# EasyEDA Pro project 无刷电机驱动板.epro, schematic Schematic2
Board Name: cyt无刷电机驱动V1.2; Create Date: 2025-03-28; Page Name: P1; Project Name: 无刷电机驱动板; Schematic Name: Schematic2; Update Date: 2025-07-04; Company: 海思路999号412所; Drawed: YienMaster; Page Size: A3; Version: V1.0
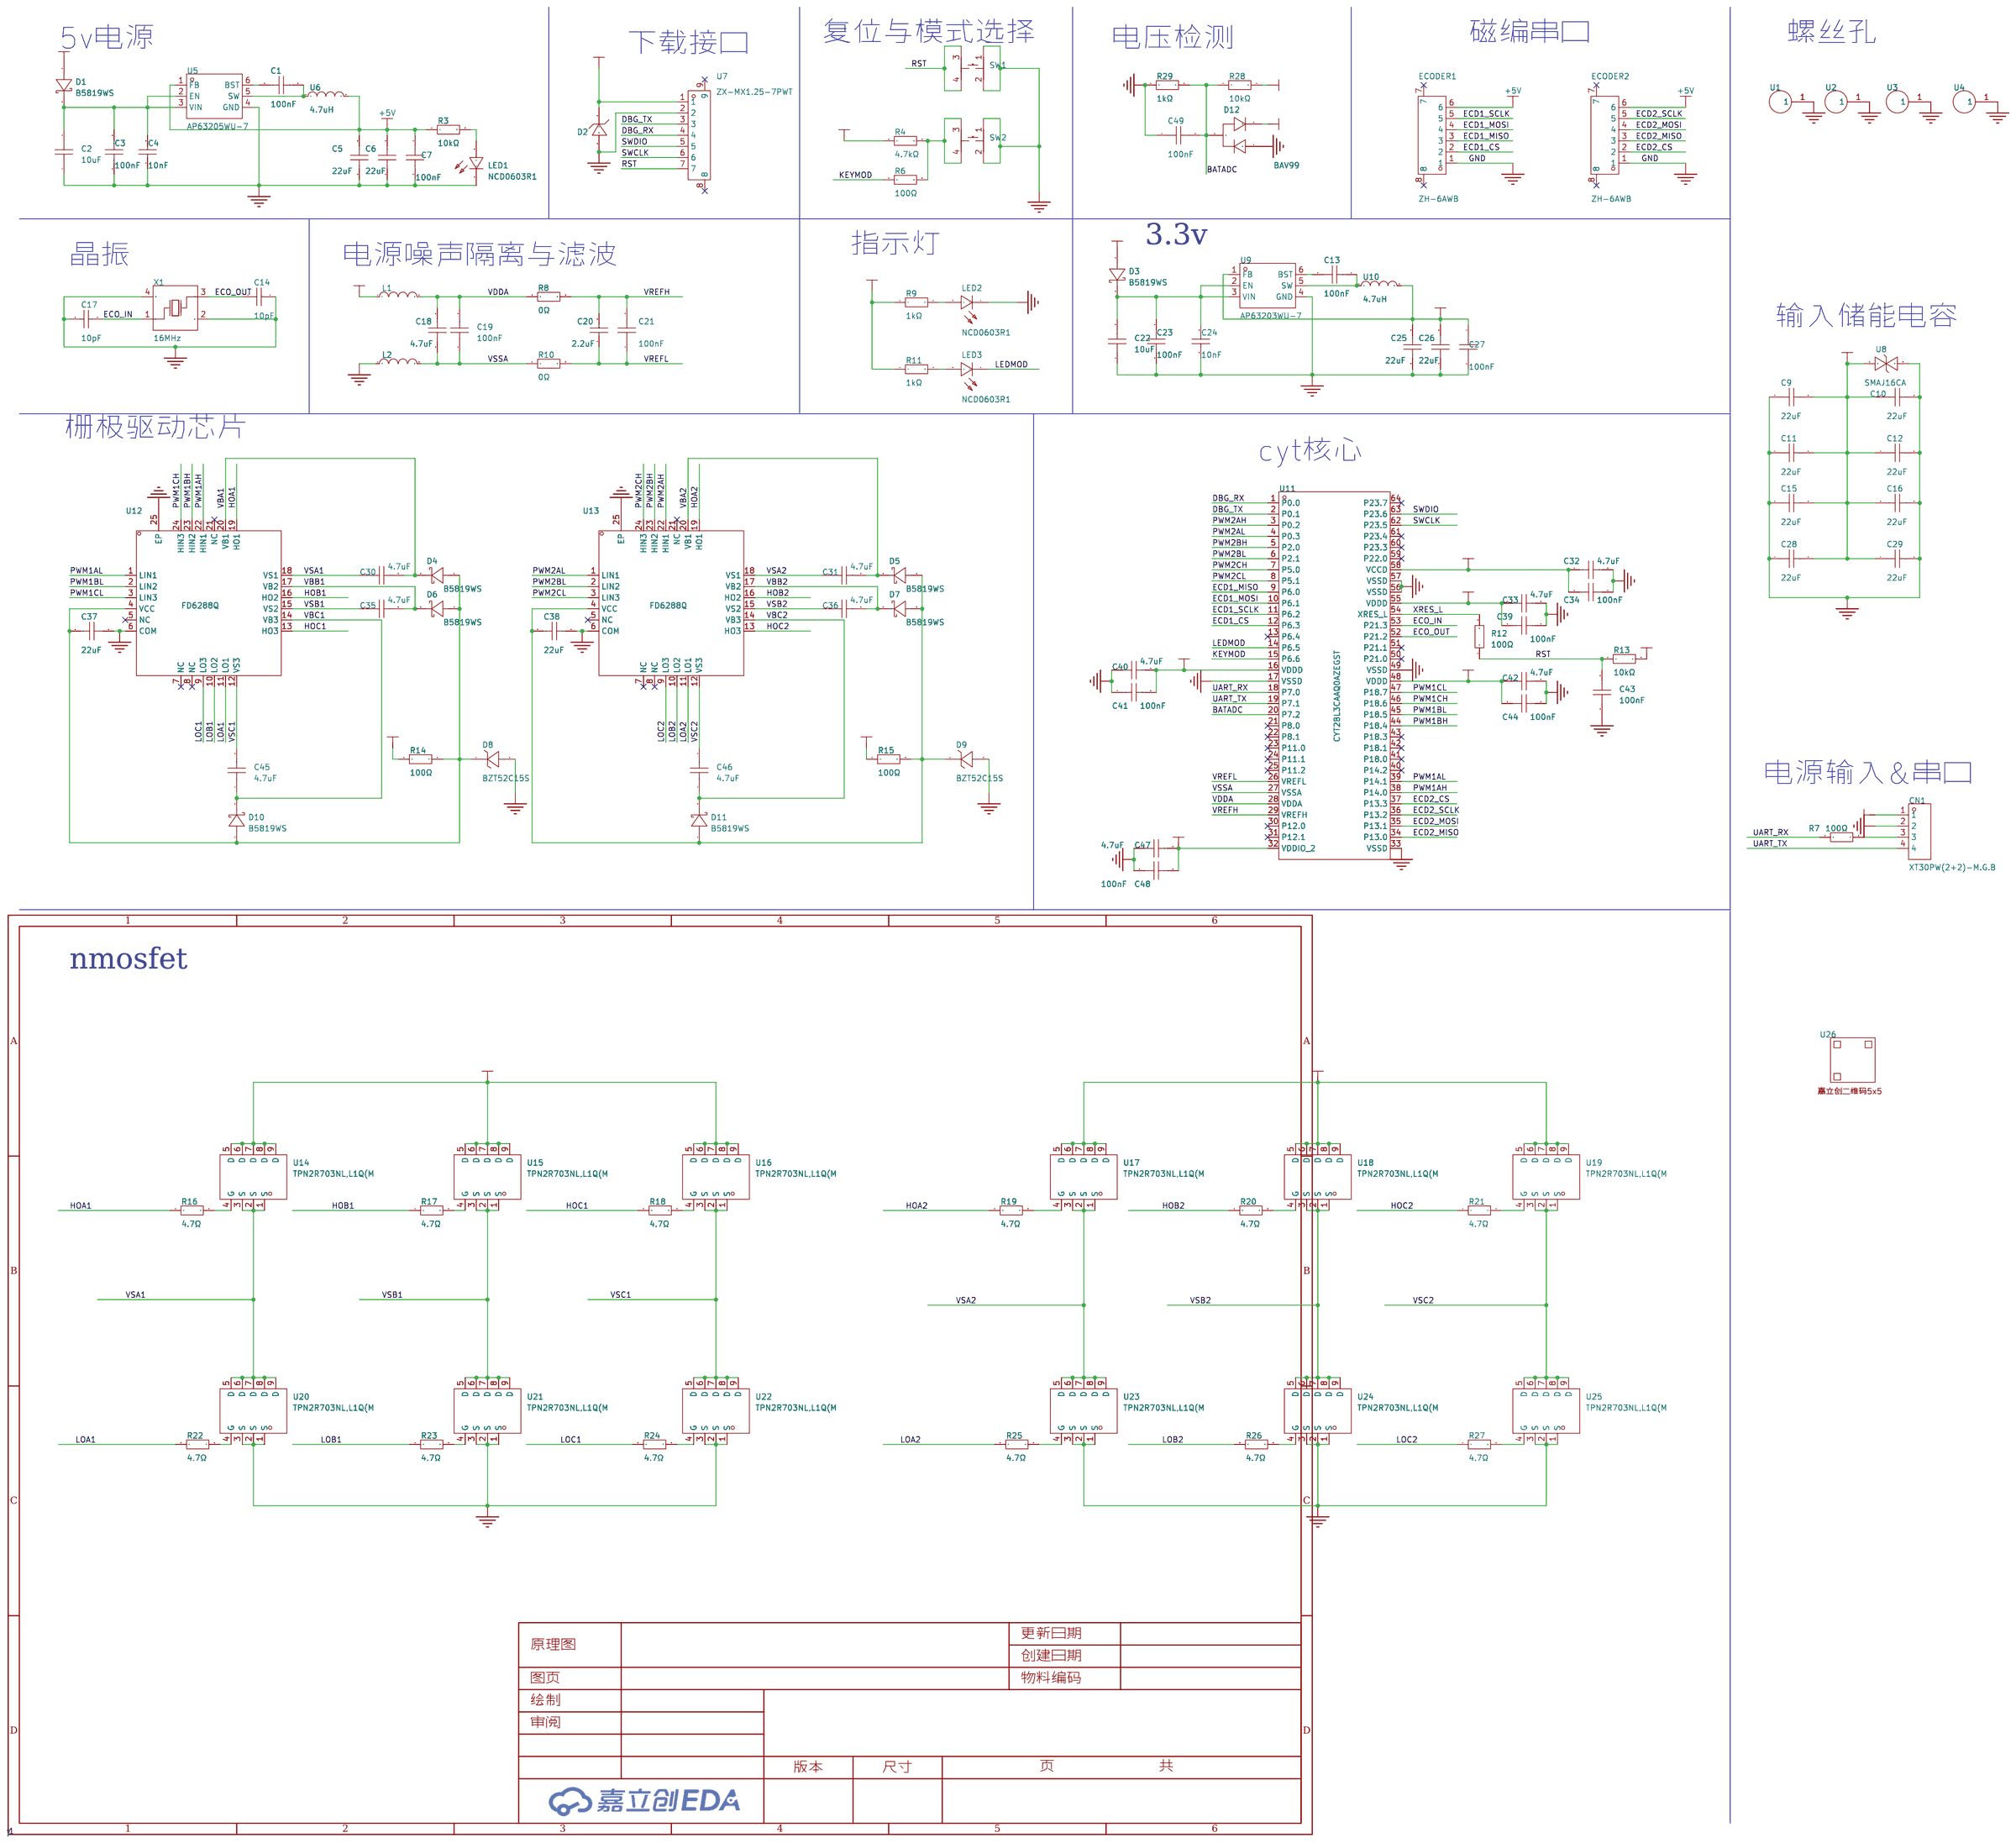
[diagram p3: schematic sheet]

## Parts
C1  100nF  [C0603]
C2  10uF  [C0603]
C3  100nF  [C0603]
C4  10nF  [C0603]
C5  22uF  [C0603]
C6  22uF  [C0603]
C7  100nF  [C0603]
C9  22uF  [C0805]
C10  22uF  [C0805]
C11  22uF  [C0805]
C12  22uF  [C0805]
C13  100nF  [C0603]
C14  10pF  [C0603]
C15  22uF  [C0805]
C16  22uF  [C0805]
C17  10pF  [C0603]
C18  4.7uF  [C0603]
C19  100nF  [C0603]
C20  2.2uF  [C0603]
C21  100nF  [C0603]
C22  10uF  [C0603]
C23  100nF  [C0603]
C24  10nF  [C0603]
C25  22uF  [C0603]
C26  22uF  [C0603]
C27  100nF  [C0603]
C28  22uF  [C0805]
C29  22uF  [C0805]
C30  4.7uF  [C0603]
C31  4.7uF  [C0603]
C32  4.7uF  [C0603]
C33  4.7uF  [C0603]
C34  100nF  [C0603]
C35  4.7uF  [C0603]
C36  4.7uF  [C0603]
C37  22uF  [C0805]
C38  22uF  [C0805]
C39  100nF  [C0603]
C40  4.7uF  [C0603]
C41  100nF  [C0603]
C42  4.7uF  [C0603]
C43  100nF  [C0603]
C44  100nF  [C0603]
C45  4.7uF  [C0603]
C46  4.7uF  [C0603]
C47  4.7uF  [C0603]
C48  100nF  [C0603]
C49  100nF  [C0603]
CN1  XT30PW(2+2)-M.G.B  [CONN-TH_4P-XT30PW-M]
D1  B5819WS  [SOD-323_L1.7-W1.3-LS2.5-FD]
D2  SMF3.3A  [SOD-123_L2.8-W1.8-LS3.7-RD]
D3  B5819WS  [SOD-323_L1.7-W1.3-LS2.5-FD]
D4  B5819WS  [SOD-323_L1.7-W1.3-LS2.5-FD]
D5  B5819WS  [SOD-323_L1.7-W1.3-LS2.5-FD]
D6  B5819WS  [SOD-323_L1.7-W1.3-LS2.5-FD]
D7  B5819WS  [SOD-323_L1.7-W1.3-LS2.5-FD]
D8  BZT52C15S  [SOD-323_L1.7-W1.3-LS2.6-RD]
D9  BZT52C15S  [SOD-323_L1.7-W1.3-LS2.6-RD]
D10  B5819WS  [SOD-323_L1.7-W1.3-LS2.5-FD]
D11  B5819WS  [SOD-323_L1.7-W1.3-LS2.5-FD]
D12  BAV99  [SOT-23_L2.9-W1.3-P1.90-LS2.4-BR]
ECODER1  ZH-6AWB  [CONN-SMD_6P-P1.50_ZH-6AWB]
ECODER2  ZH-6AWB  [CONN-SMD_6P-P1.50_ZH-6AWB]
L1  BLM18PG121SN1D  [L0603]
L2  BLM18PG121SN1D  [L0603]
LED1  NCD0603R1  [LED0603-RD_RED]
LED2  NCD0603R1  [LED0603-RD_RED]
LED3  NCD0603R1  [LED0603-RD_RED]
R3  10kΩ  [R0603]
R4  4.7kΩ  [R0603]
R6  100Ω  [R0603]
R7  100Ω  [R0603]
R8  0Ω  [R0603]
R9  1kΩ  [R0603]
R10  0Ω  [R0603]
R11  1kΩ  [R0603]
R12  100Ω  [R0603]
R13  10kΩ  [R0603]
R14  100Ω  [R0603]
R15  100Ω  [R0603]
R16  4.7Ω  [R0603]
R17  4.7Ω  [R0603]
R18  4.7Ω  [R0603]
R19  4.7Ω  [R0603]
R20  4.7Ω  [R0603]
R21  4.7Ω  [R0603]
R22  4.7Ω  [R0603]
R23  4.7Ω  [R0603]
R24  4.7Ω  [R0603]
R25  4.7Ω  [R0603]
R26  4.7Ω  [R0603]
R27  4.7Ω  [R0603]
R28  10kΩ  [R0603]
R29  1kΩ  [R0603]
SW1  TS3425BA  [SW-SMD_4P-L4.2-W3.2-P2.15-LS4.6-1]
SW2  TS3425BA  [SW-SMD_4P-L4.2-W3.2-P2.15-LS4.6-1]
U1  -  [M3螺丝孔]  (no BOM)
U2  -  [M3螺丝孔]  (no BOM)
U3  -  [M3螺丝孔]  (no BOM)
U4  -  [M3螺丝孔]  (no BOM)
U5  AP63205WU-7  [TSOT-23-6_L2.9-W1.6-P0.95-LS2.8-BL]
U6  4.7uH  [IND-SMD_L3.0-W3.0_FTC303020D]
U7  ZX-MX1.25-7PWT  [CONN-SMD_7P-P1.25_ZX-MX1.25-7PWT]
U8  SMAJ16CA  [DO-214AC_L4.3-W2.7-LS5.0-BI]
U9  AP63203WU-7  [TSOT-26_L2.9-W1.6-P0.95-LS2.8-BL]
U10  4.7uH  [IND-SMD_L3.0-W3.0_FTC303020D]
U11  CYT2BL3CAAQ0AZEGST  [LQFP-64_L10.0-W10.0-P0.50-LS12.0-BL]
U12  FD6288Q  [QFN-24_L4.0-W4.0-P0.50-BL-EP2.6]
U13  FD6288Q  [QFN-24_L4.0-W4.0-P0.50-BL-EP2.6]
U14  TPN2R703NL,L1Q(M  [TSON-8_L3.1-W3.1-P0.65-LS3.3-BL-EP]
U15  TPN2R703NL,L1Q(M  [TSON-8_L3.1-W3.1-P0.65-LS3.3-BL-EP]
U16  TPN2R703NL,L1Q(M  [TSON-8_L3.1-W3.1-P0.65-LS3.3-BL-EP]
U17  TPN2R703NL,L1Q(M  [TSON-8_L3.1-W3.1-P0.65-LS3.3-BL-EP]
U18  TPN2R703NL,L1Q(M  [TSON-8_L3.1-W3.1-P0.65-LS3.3-BL-EP]
U19  TPN2R703NL,L1Q(M  [TSON-8_L3.1-W3.1-P0.65-LS3.3-BL-EP]
U20  TPN2R703NL,L1Q(M  [TSON-8_L3.1-W3.1-P0.65-LS3.3-BL-EP]
U21  TPN2R703NL,L1Q(M  [TSON-8_L3.1-W3.1-P0.65-LS3.3-BL-EP]
U22  TPN2R703NL,L1Q(M  [TSON-8_L3.1-W3.1-P0.65-LS3.3-BL-EP]
U23  TPN2R703NL,L1Q(M  [TSON-8_L3.1-W3.1-P0.65-LS3.3-BL-EP]
U24  TPN2R703NL,L1Q(M  [TSON-8_L3.1-W3.1-P0.65-LS3.3-BL-EP]
U25  TPN2R703NL,L1Q(M  [TSON-8_L3.1-W3.1-P0.65-LS3.3-BL-EP]
U26  -  [JLC-QRCODE-5x5]
X1  16MHz  [CRYSTAL-SMD_4P-L3.2-W2.5-BL]

## Library data of the parts
C1 C3 C7 C13 C19 C21 C23 C27 C34 C39 C41 C43 C44 C48 = CGA0603X7R104K500JT: 容值:100nF;精度:±10%;额定电压:50V;材质(温度系数):X7R;; LCSC Part Name: 100nF ±10% 50V; Supplier Part: C6119867; Manufacturer: HRE(芯声); Supplier Footprint: 0603; JLCPCB Part Class: 扩展库; Supplier: LCSC; Tolerance: ±10%; Voltage Rated: 50V; Temperature Coefficient: X7R
C2 C22 = CL10A106MA8NRNC: 容值:10uF;精度:±20%;额定电压:25V;材质(温度系数):X5R;; LCSC Part Name: 10uF ±20% 25V; Supplier Part: C96446; Manufacturer: SAMSUNG(三星); Supplier Footprint: 0603; JLCPCB Part Class: 基础库; Datasheet: https://atta.szlcsc.com/upload/public/pdf/source/20160218/1457707763339.pdf; Supplier: LCSC; Tolerance: ±20%; Voltage Rated: 25V; Temperature Coefficient: X5R
C4 C24 = CC0603KRX7R9BB103: 容值:10nF;精度:±10%;额定电压:50V;材质(温度系数):X7R;; LCSC Part Name: 10nF ±10% 50V; Supplier Part: C100042; Manufacturer: YAGEO(国巨); Supplier Footprint: 0603; JLCPCB Part Class: 扩展库; Datasheet: https://atta.szlcsc.com/upload/public/pdf/source/20181008/C309510_22F155564471FAF6A489F7D68F34234E.pdf; Supplier: LCSC; Tolerance: ±10%; Voltage Rated: 50V; Temperature Coefficient: X7R
C5 C6 C25 C26 = CGA0603X5R226M160JT: 容值:22uF;精度:±20%;额定电压:16V;材质(温度系数):X5R;; LCSC Part Name: 22uF ±20% 16V; Supplier Part: C6119868; Manufacturer: HRE(芯声); Supplier Footprint: 0603; JLCPCB Part Class: 扩展库; Supplier: LCSC; Tolerance: ±20%; Voltage Rated: 16V; Temperature Coefficient: X5R
C9-C12 C15 C16 C28 C29 C37 C38 = CGA0805X5R226M350MT: 容值:22uF;精度:±20%;额定电压:35V;材质(温度系数):X5R;; LCSC Part Name: 22uF ±20% 35V; Supplier Part: C6119901; Manufacturer: HRE(芯声); Supplier Footprint: 0805; JLCPCB Part Class: 扩展库; Datasheet: https://atta.szlcsc.com/upload/public/pdf/source/20231129/D589D0CC4D260F7AC3A77E53B455CCB3.pdf; Supplier: LCSC; Tolerance: ±20%; Voltage Rated: 35V; Temperature Coefficient: X5R
C14 C17 = CC0603JRNPO9BN100: 容值:10pF;精度:±5%;额定电压:50V;材质(温度系数):NP0;; LCSC Part Name: 10pF ±5% 50V; Supplier Part: C106245; Manufacturer: YAGEO(国巨); Supplier Footprint: 0603; JLCPCB Part Class: 扩展库; Datasheet: https://atta.szlcsc.com/upload/public/pdf/source/20170505/1493957838062.pdf; Supplier: LCSC; Tolerance: ±5%; Voltage Rated: 50V; Temperature Coefficient: NP0
C18 C30-C33 C35 C36 C40 C42 C45-C47 = CL10A475KA8NQNC: 容值:4.7uF;精度:±10%;额定电压:25V;材质(温度系数):X5R;; LCSC Part Name: 4.7uF ±10% 25V; Supplier Part: C69335; Manufacturer: SAMSUNG(三星); Supplier Footprint: 0603; JLCPCB Part Class: Extended Part; Datasheet: https://atta.szlcsc.com/upload/public/pdf/source/20161108/1478586410580.pdf; Supplier: LCSC; Tolerance: ±10%; Voltage Rated: 25V; Temperature Coefficient: X5R
C20 = CL10A225KO8NNNC: 容值:2.2uF;精度:±10%;额定电压:16V;材质(温度系数):X5R;; LCSC Part Name: 2.2uF ±10% 16V; Supplier Part: C23630; Manufacturer: SAMSUNG(三星); Supplier Footprint: 0603; JLCPCB Part Class: 基础库; Datasheet: https://atta.szlcsc.com/upload/public/pdf/source/20160218/1457707763339.pdf; Supplier: LCSC; Tolerance: ±10%; Voltage Rated: 16V; Temperature Coefficient: X5R
C49 = CAP_0603: Supplier Footprint: 0603
CN1 = XT30PW(2+2)-M.G.B: LCSC Part Name: XT30PW(2+2)功率数据混合插头公金黑PCB弯插; Supplier Part: C19268030; Manufacturer: AMASS(艾迈斯); JLCPCB Part Class: 扩展库; Datasheet: https://atta.szlcsc.com/upload/public/pdf/source/20240112/A815AE62CB016131F8636555ECBDABF7.pdf; Supplier: LCSC
D1 D3-D7 D10 D11 = B5819WS_C7420331: 二极管配置:独立式;正向压降(Vf):600mV@1.0A;直流反向耐压(Vr):40V;整流电流:1A;; LCSC Part Name: 电压:40V 电流:1A; Supplier Part: C7420331; Manufacturer: 宏迦橙; Supplier Footprint: SOD-323; JLCPCB Part Class: 扩展库; Datasheet: https://atta.szlcsc.com/upload/public/pdf/source/20230828/03CA0F4F90DAE368A7153B7B5E4D0651.pdf; Supplier: LCSC; Diode Configuration: 独立式; Forward Voltage (Vf@If): 600mV@1.0A; Reverse Voltage (Vr): 40V; Rectified Current: 1A; Reverse Leakage Current (Ir): 1mA@40V
D2 = SMF3.3A_C37331473: 极性:单向;反向截止电压(Vrwm):3.3V;钳位电压:7.3V;峰值脉冲电流(Ipp):27.4A;峰值脉冲功率(Ppp):200W;击穿电压:4.3V;; Supplier Part: C37331473; Manufacturer: GOODWORK(固得沃克); Supplier Footprint: SOD-123FL; Datasheet: https://atta.szlcsc.com/upload/public/pdf/source/20240801/D4B373D0611F6B4675800B8155207CFE.pdf; Supplier: LCSC; Polarity: 单向; Reverse Stand-Off Voltage (Vrwm): 3.3V; Clamping Voltage: 7.3V; Peak Pulse Current (Ipp): 27.4A; Peak Pulse Power Dissipation (Ppp): 200W; Voltage - Breakdown: 4.3V; Number of Channels: 单路; Operating Temperature: -55℃~+150℃@(Tj); Type: TVS
D8 D9 = BZT52C15S_C19077448: 二极管配置:独立式;稳压值(标称值):15V;稳压值(范围):13.8V~15.6V;功率(Pd):200mW;; Supplier Part: C19077448; Manufacturer: 宏迦橙; Supplier Footprint: SOD-323; JLCPCB Part Class: 扩展库; Datasheet: https://atta.szlcsc.com/upload/public/pdf/source/20231117/06CD1C2A69B3FFC97FEAE4263E1B2FE9.pdf; Supplier: LCSC; Diode Configuration: 独立式; Zener Voltage (Nom): 15V; Reverse Leakage Current (Ir): 100nA@10.5V; Zener Voltage (Range): 13.8V~15.6V; Power Dissipation: 200mW; Zener Impedance (Zzt): 30Ω
D12 = BAV99_C408392: 二极管配置:1对串联式;正向压降(Vf):1.25V@150mA;直流反向耐压(Vr):70V;整流电流:200mA;反向恢复时间(trr):6ns;; LCSC Part Name: 电压:70V 电流:200mA; Supplier Part: C408392; Manufacturer: MDD(辰达半导体); Supplier Footprint: SOT-23; JLCPCB Part Class: 扩展库; Datasheet: https://atta.szlcsc.com/upload/public/pdf/source/20240710/712A41600A6652723ABF2FD56C16FE3C.pdf; Supplier: LCSC; Diode Configuration: 1对串联式; Forward Voltage (Vf@If): 1.25V@150mA; Reverse Voltage (Vr): 70V; Rectified Current: 200mA; Reverse Leakage Current: 2.5uA@70V; Reverse Recovery Time (trr): 6ns
ECODER1 ECODER2 = ZH-6AWB: 插针结构:1x6P;间距:1.5mm;安装方式:卧贴;排数:1;每排PIN数:6;额定电流:1A;工作温度范围:-35℃~+105℃;; LCSC Part Name: 1x6P 间距:1.5mm 卧贴; Supplier Part: C22362540; Manufacturer: DLL(德利); Supplier Footprint: SMD,P=1.5mm,卧贴; JLCPCB Part Class: 扩展库; Datasheet: https://atta.szlcsc.com/upload/public/pdf/source/20240315/7DDE1F11515AF3573E6DDAC219035CCF.pdf; Supplier: LCSC; Pins Structure: 1x6P; Pitch: 1.5mm; Mounting Style: 卧贴; Number of Rows: 1; Number of PINs Per Row: 6; Current Rating (Max): 1A; Operating Temperature Range: -35℃~+105℃
L1 L2 = BLM18PG121SN1D: 标称阻抗@测试频率:120Ω@100MHz;误差:±25%;直流电阻(RDC):50mΩ;; LCSC Part Name: 单路 0603磁珠 阻抗120Ω@100MHz; Supplier Part: C14709; Manufacturer: muRata(村田); Supplier Footprint: 0603; JLCPCB Part Class: 扩展库; Datasheet: https://atta.szlcsc.com/upload/public/pdf/source/20130704/1457706621422.pdf; Supplier: LCSC; Impedance @ Frequency: 120Ω@100MHz; Tolerance: ±25%; DC Resistance: 50mΩ; Current Rating: 2A; Circuits: 1
LED1-LED3 = NCD0603R1_C84263: 灯头类型:-;发光颜色:红色;正向电压(VF):1.6V~2.6V;功率:65mW;正向电流:20mA;主波长:615nm~630nm;二极管配置:独立二极管;透镜颜色:无色透明透镜;色温:-;发光强度:80mcd~220mcd;发光角度:130°;载带方式:-;工作温度:-30℃~+85℃;; Supplier Part: C84263; Manufacturer: 国星光电; Supplier Footprint: 0603; JLCPCB Part Class: 扩展库; Datasheet: https://atta.szlcsc.com/upload/public/pdf/source/20200820/C84263_DABC6A75E58F576973B407FDBA283D60.pdf; Supplier: LCSC; Emitted Color: 红色; Forward Voltage (VF): 1.6V~2.6V; Power Dissipation: 65mW; Forward Current: 20mA; Dominant Wavelength: 615nm~630nm; Diode Configuration: 独立二极管; Lens Color: 无色透明透镜; Luminous Intensity: 80mcd~220mcd; Viewing Angle: 130°; Operating Temperature: -30℃~+85℃
R3 R13 R28 = 0603WAF1002T5E: 电阻类型:厚膜电阻;阻值:10kΩ;精度:±1%;功率:100mW;最大工作电压:75V;温度系数:±100ppm/℃;; LCSC Part Name: 厚膜电阻 10kΩ ±1% 100mW; Supplier Part: C25804; Manufacturer: UNI-ROYAL(厚声); Supplier Footprint: 0603; JLCPCB Part Class: 基础库; Datasheet: https://atta.szlcsc.com/upload/public/pdf/source/20200306/C422600_1E6D84923E4A46A82E41ADD87F860B5C.pdf; Supplier: LCSC; Type: 厚膜电阻; Tolerance: ±1%; Power(Watts): 100mW; Overload Voltage (Max): 75V; Temperature Coefficient: ±100ppm/℃; Operating Temperature Range: -55℃~+155℃
R4 = RC0603FR-074K7L: 电阻类型:厚膜电阻;阻值:4.7kΩ;精度:±1%;功率:100mW;最大工作电压:75V;温度系数:±100ppm/℃;; LCSC Part Name: 厚膜电阻 4.7kΩ ±1% 100mW; Supplier Part: C99782; Manufacturer: YAGEO(国巨); Supplier Footprint: 0603; JLCPCB Part Class: 扩展库; Datasheet: https://atta.szlcsc.com/upload/public/pdf/source/20180224/C181757_15194369480721363983.pdf; Supplier: LCSC; Type: 厚膜电阻; Tolerance: ±1%; Power(Watts): 100mW; Overload Voltage (Max): 75V; Temperature Coefficient: ±100ppm/℃; Operating Temperature Range: -55℃~+155℃
R6 R7 R12 R14 R15 = 0603WAF1000T5E: 电阻类型:厚膜电阻;阻值:100Ω;精度:±1%;功率:100mW;最大工作电压:75V;温度系数:±200ppm/℃;; LCSC Part Name: 100Ω ±1% 100mW 厚膜电阻; Supplier Part: C22775; Manufacturer: UNI-ROYAL(厚声); Supplier Footprint: 0603; JLCPCB Part Class: 基础库; Datasheet: https://atta.szlcsc.com/upload/public/pdf/source/20200306/C422600_1E6D84923E4A46A82E41ADD87F860B5C.pdf; Supplier: LCSC; Type: 厚膜电阻; Tolerance: ±1%; Power(Watts): 100mW; Overload Voltage (Max): 75V; Temperature Coefficient: ±200ppm/℃; Operating Temperature Range: -55℃~+155℃
R8 R10 = 0603WAF0000T5E: 电阻类型:厚膜电阻;阻值:0Ω;精度:±1%;功率:100mW;最大工作电压:75V;; LCSC Part Name: 0Ω ±1% 100mW 厚膜电阻; Supplier Part: C21189; Manufacturer: UNI-ROYAL(厚声); Supplier Footprint: 0603; JLCPCB Part Class: 基础库; Datasheet: https://atta.szlcsc.com/upload/public/pdf/source/20200306/C422600_1E6D84923E4A46A82E41ADD87F860B5C.pdf; Supplier: LCSC; Type: 厚膜电阻; Tolerance: ±1%; Power(Watts): 100mW; Overload Voltage (Max): 75V; Operating Temperature Range: -55℃~+155℃
R9 R11 R29 = 0603WAF1001T5E: 电阻类型:厚膜电阻;阻值:1kΩ;精度:±1%;功率:100mW;最大工作电压:75V;温度系数:±100ppm/℃;; LCSC Part Name: 1kΩ ±1% 100mW 厚膜电阻; Supplier Part: C21190; Manufacturer: UNI-ROYAL(厚声); Supplier Footprint: 0603; JLCPCB Part Class: 基础库; Datasheet: https://atta.szlcsc.com/upload/public/pdf/source/20200306/C422600_1E6D84923E4A46A82E41ADD87F860B5C.pdf; Supplier: LCSC; Type: 厚膜电阻; Tolerance: ±1%; Power(Watts): 100mW; Overload Voltage (Max): 75V; Temperature Coefficient: ±100ppm/℃; Operating Temperature Range: -55℃~+155℃
R16-R27 = 0603WAF470KT5E: 电阻类型:厚膜电阻;阻值:4.7Ω;精度:±1%;功率:100mW;最大工作电压:75V;温度系数:±400ppm/℃;; LCSC Part Name: 4.7Ω ±1% 100mW 厚膜电阻; Supplier Part: C23164; Manufacturer: UNI-ROYAL(厚声); Supplier Footprint: 0603; JLCPCB Part Class: 基础库; Datasheet: https://atta.szlcsc.com/upload/public/pdf/source/20200306/C422600_1E6D84923E4A46A82E41ADD87F860B5C.pdf; Supplier: LCSC; Type: 厚膜电阻; Tolerance: ±1%; Power(Watts): 100mW; Overload Voltage (Max): 75V; Temperature Coefficient: ±400ppm/℃; Operating Temperature Range: -55℃~+155℃
SW1 SW2 = TS3425BA: 电路结构:单刀单掷;按钮形状:椭圆形按钮;作用力:250gf;安装方式:立贴;开关长度:4.2mm;开关宽度:3.2mm;开关高度:2.5mm;带支架:不带;触点电流:50mA;额定电压(DC):12V;绝缘电阻:100MΩ;机械寿命:10万次;; LCSC Part Name: 4.2*3.2*2.5mm 立贴 轻触开关; Supplier Part: C2681476; Manufacturer: SHOU HAN(首韩); Supplier Footprint: SMD; JLCPCB Part Class: 扩展库; Datasheet: https://atta.szlcsc.com/upload/public/pdf/source/20210107/C2681476_BF217B2301F0070AA49504CB0BFDE895.pdf; Supplier: LCSC; Circuit: 单刀单掷; Actuator Style: 椭圆形按钮; Operating Force: 250gf; Mounting Style: 立贴; Switch Length: 4.2mm; Switch Width: 3.2mm; Switch Height: 2.5mm; Strike Gundam: 不带; Contact Current: 50mA; Voltage Rating (DC): 12V; Insulation Resistance: 100MΩ; Actuator/Cap Color: 白色; Pin Style: J型引脚; Mechanical Life: 10万次; Operating Temperature: -20℃~+85℃
U1-U4 = M3螺丝孔
U5 = AP63205WU-7: 功能类型:降压型;输出类型:固定;输入电压:3.8V~32V;输出电压:5V;输出电流:2A;; LCSC Part Name: 3.8V至32V输入、2A低静态电流同步降压转换器，增强EMI抑制; Supplier Part: C2071056; Manufacturer: DIODES(美台); Supplier Footprint: TSOT-23-6; JLCPCB Part Class: 扩展库; Datasheet: https://atta.szlcsc.com/upload/public/pdf/source/20210622/C780769_099C67289BD3EC61AAFB52D8B07125B3.pdf; Supplier: LCSC; Function: 降压型; Output Type: 固定; Input Voltage: 3.8V~32V; Output Voltage: 5V; Output Current: 2A; Switching Frequency: 1.1MHz; Operating Temperature: -40℃~+85℃@(TA); Synchronous Rectification: 是; Number of Outputs: 1; Topology: 降压式; Quiescent Current (Iq): 22uA; Switch tube (built-in/external): 内置
U6 U10 = FTC303018D4R7MBCA: 电感值:4.7uH;精度:±20%;额定电流:3.4A;饱和电流(Isat):4.7A;类型:一体成型电感;; LCSC Part Name: 4.7uH ±20% 4.7A; Supplier Part: C5832388; Manufacturer: cjiang(长江微电); Supplier Footprint: SMD,3x3mm; JLCPCB Part Class: 扩展库; Datasheet: https://atta.szlcsc.com/upload/public/pdf/source/20230602/8FFEDA9C0247A92A0D4B67554BFE4091.pdf; Supplier: LCSC; Tolerance: ±20%; Rated Current: 3.4A; Saturation Current (Isat): 4.7A; DC Resistance (DCR): 72mΩ; Type: 一体成型电感
U7 = ZX-MX1.25-7PWT: 插针结构:1x7P;间距:1.25mm;安装方式:卧贴;参考系列:PicoBlade(MX 1.25);总PIN数:7P;排数:1;每排PIN数:7;行距:-;额定电流:-;触头材质:黄铜;触头镀层:锡;工作温度范围:-;; LCSC Part Name: 1x7P 间距:1.25mm 卧贴 系列:PicoBlade(MX 1.25) 配套胶壳型号：ZX-MX1.25-7PJK 配套端子型号：ZX-MX1.25-DZ配套杜邦线型号：ZX-MX1.25-7PBXC; Supplier Part: C19272380; Manufacturer: Megastar(兆星); Supplier Footprint: SMD,P=1.25mm,卧贴; JLCPCB Part Class: 扩展库; Datasheet: https://atta.szlcsc.com/upload/public/pdf/source/20231201/7A0E4B8E8DD57392260B4DFAD27BB681.pdf; Supplier: LCSC; Pins Structure: 1x7P; Pitch: 1.25mm; Mounting Style: 卧贴; Reference Series: PicoBlade(MX 1.25); Number of Pins: 7P; Number of Rows: 1; Number of PINs Per Row: 7; Contact Material: 黄铜; Contact Plating: 锡; Supplementary Features: 辅助焊脚; Colour: 米色; Z-Height of the Board: 3.6mm; X-Length of Bottom Edge on Board (Spacing Line): 13.75mm; Y-Width of Bottom Edge on Board: 5.25mm
U8 = SMAJ16CA_C19077537: 极性:双向;反向截止电压(Vrwm):16V;钳位电压:26V;峰值脉冲电流(Ipp):15.4A;峰值脉冲功率(Ppp):400W;击穿电压:19.7V;; Supplier Part: C19077537; Manufacturer: 宏嘉诚; Supplier Footprint: SMA; JLCPCB Part Class: 扩展库; Datasheet: https://atta.szlcsc.com/upload/public/pdf/source/20250107/539D2DC1EE5F9F3FCEFE35DA61E92AD9.pdf; Supplier: LCSC; Polarity: 双向; Reverse Stand-Off Voltage (Vrwm): 16V; Clamping Voltage: 26V; Peak Pulse Current (Ipp): 15.4A; Peak Pulse Power Dissipation (Ppp): 400W; Voltage - Breakdown: 19.7V; Reverse Leakage Current (Ir): 1uA; Type: TVS
U9 = AP63203WU-7: 功能类型:降压型;输出类型:固定;输入电压:3.8V~32V;输出电压:3.3V;输出电流:2A;; LCSC Part Name: 3.8V至32V输入、2A低静态电流同步降压转换器，增强EMI抑制; Supplier Part: C780769; Manufacturer: DIODES(美台); Supplier Footprint: TSOT-23-6; JLCPCB Part Class: 扩展库; Datasheet: https://atta.szlcsc.com/upload/public/pdf/source/20210622/C780769_099C67289BD3EC61AAFB52D8B07125B3.pdf; Supplier: LCSC; Function: 降压型; Output Type: 固定; Input Voltage: 3.8V~32V; Output Voltage: 3.3V; Output Current: 2A; Switching Frequency: 1.1MHz; Operating Temperature: -40℃~+85℃@(TA); Synchronous Rectification: 是; Number of Outputs: 1; Topology: 降压式; Quiescent Current (Iq): 22uA; Switch tube (built-in/external): 内置
U11 = CYT2BL3CAAQ0AZEGST: CPU内核:ARM-M4；ARM-M0+;CPU最大主频:100MHz；160MHz;应用领域:-;; Supplier Part: C6814187; Manufacturer: Infineon(英飞凌); Supplier Footprint: LQFP-64(10x10); Datasheet: https://atta.szlcsc.com/upload/public/pdf/source/20241028/9C5F45A22757023D6821BF2A2597B3D9.pdf; Supplier: LCSC; CPU Core: ARM-M4；ARM-M0+; CPU Maximum Speed: 100MHz；160MHz; Number of I/O: 49; ADC (Bit): 12bit; Low Voltage Detection Threshold: 2.7V~5.5V
U12 U13 = FD6288Q: Supplier Part: C328453; Manufacturer: Fortior Tech(峰岹); Supplier Footprint: QFN-24-EP(4x4); JLCPCB Part Class: 扩展库; Datasheet: https://atta.szlcsc.com/upload/public/pdf/source/20241101/0E2856EB301EAFFED732065FB088D773.pdf; Supplier: LCSC
U14-U25 = TPN2R703NL,L1Q(M: 类型:1个N沟道;漏源电压(Vdss):30V;连续漏极电流(Id):-;导通电阻(RDS(on)@Vgs,Id):3.3mΩ@4.5V,22.5A;功率:42W;阈值电压(Vgs(th)@Id):1.3V@0.3mA;; Supplier Part: C5307666; Manufacturer: TOSHIBA(东芝); Supplier Footprint: TSON-8; JLCPCB Part Class: 扩展库; Datasheet: https://atta.szlcsc.com/upload/public/pdf/source/20221207/F3F28B90115C5E074AC0CD2ED28456D7.pdf; Supplier: LCSC; Type: 1个N沟道; Drain Source Voltage (Vdss): 30V; Drain Source On Resistance (RDS(on)@Vgs,Id): 3.3mΩ@4.5V,22.5A; Power Dissipation (Pd): 42W; Gate Threshold Voltage (Vgs(th)@Id): 1.3V@0.3mA; Input Capacitance (Ciss@Vds): 1.6nF@15V; Reverse Transfer Capacitance (Crss@Vds): 53pF@15V
U26 = 嘉立创二维码5x5
X1 = TAXM16M4RLBCCT2T: 晶振类型:贴片晶振;频率:16MHz;常温频差:±10ppm;负载电容:20pF;频率稳定度(全温):±15ppm;; LCSC Part Name: 16MHz ±10ppm 20pF; Supplier Part: C164049; Manufacturer: YJX(雅晶鑫); Supplier Footprint: SMD3225-4P; JLCPCB Part Class: 扩展库; Datasheet: https://atta.szlcsc.com/upload/public/pdf/source/20200713/C164049_7D9D040C2FDFEE55E99A1CB38C95A19D.pdf; Supplier: LCSC; Crystal Type: 贴片晶振; Normal temperature Frequency Tolerance: ±10ppm; Load Capacitor: 20pF; Frequency Stability(Full temperature range): ±15ppm; Equivalent Series Resistance (ESR): 40Ω; Operating Temperature: -40℃~+85℃

## Nets
+5V: C5.2 C6.2 C7.1 ECODER1.6 ECODER2.6 R3.1 U5.1(FB) U6.2
GND: C2.1 C3.1 C4.1 C5.1 C6.1 C7.2 C9.1 C10.2 C11.1 C12.2 C14.2 C15.1 C16.2 C17.1 C22.1 C23.1 C24.1 C25.1 C26.1 C27.2 C28.1 C29.2 C32.2 C33.2 C34.2 C37.1 C38.1 C39.2 C40.1 C41.1 C42.2 C43.1 C44.2 C47.1 C48.1 C49.1 CN1.2 D2.2 D8.2(A) D9.2(A) D12.1 ECODER1.1 ECODER2.1 L2.1 LED1.1(K) LED2.1(K) R29.1 SW1.1 SW1.2 SW2.1 SW2.2 U1.1 U2.1 U3.1 U4.1 U5.4(GND) U7.2 U8.2 U9.4(GND) U11.17(VSSD) U11.33(VSSD) U11.49(VSSD) U11.56(VSSD) U11.57(VSSD) U12.6(COM) U12.25(EP) U13.6(COM) U13.25(EP) U20.1(S) U20.2(S) U20.3(S) U21.1(S) U21.2(S) U21.3(S) U22.1(S) U22.2(S) U22.3(S) U23.1(S) U23.2(S) U23.3(S) U24.1(S) U24.2(S) U24.3(S) U25.1(S) U25.2(S) U25.3(S) X1.2(GND) X1.4(GND)
VBAT: C9.2 C10.1 C11.2 C12.1 C15.2 C16.1 C28.2 C29.1 CN1.1 D1.1(A) D3.1(A) R14.1 R15.1 R28.2 U8.1 U14.5(D) U14.6(D) U14.7(D) U14.8(D) U14.9(D) U15.5(D) U15.6(D) U15.7(D) U15.8(D) U15.9(D) U16.5(D) U16.6(D) U16.7(D) U16.8(D) U16.9(D) U17.5(D) U17.6(D) U17.7(D) U17.8(D) U17.9(D) U18.5(D) U18.6(D) U18.7(D) U18.8(D) U18.9(D) U19.5(D) U19.6(D) U19.7(D) U19.8(D) U19.9(D)
VCC1V1: C32.1 C34.1 U11.58(VCCD)
VCC3V3: C25.2 C26.2 C27.1 C33.1 C39.1 C40.2 C41.2 C42.1 C44.1 C47.2 C48.2 D2.1 D12.2 L1.1 R4.1 R9.1 R11.1 R13.2 U7.1 U9.1(FB) U10.2 U11.16(VDDD) U11.32(VDDIO_2) U11.48(VDDD) U11.55(VDDD)
VDDA: C18.2 C19.2 L1.2 R8.1 U11.28(VDDA)
VSSA: C18.1 C19.1 L2.2 R10.1 U11.27(VSSA)
BATADC: C49.2 D12.3 R28.1 R29.2 U11.20(P7.2)
DBG_RX: U7.4 U11.1(P0.0)
DBG_TX: U7.3 U11.2(P0.1)
ECD1_CS: ECODER1.2 U11.12(P6.3)
ECD1_MISO: ECODER1.3 U11.9(P6.0)
ECD1_MOSI: ECODER1.4 U11.10(P6.1)
ECD1_SCLK: ECODER1.5 U11.11(P6.2)
ECD2_CS: ECODER2.2 U11.37(P13.3)
ECD2_MISO: ECODER2.3 U11.34(P13.0)
ECD2_MOSI: ECODER2.4 U11.35(P13.1)
ECD2_SCLK: ECODER2.5 U11.36(P13.2)
ECO_IN: C17.2 U11.53(P21.3) X1.1(OSC1)
ECO_OUT: C14.1 U11.52(P21.2) X1.3(OSC2)
HOA1: R16.1 U12.19(HO1)
HOA2: R19.1 U13.19(HO1)
HOB1: R17.1 U12.16(HO2)
HOB2: R20.1 U13.16(HO2)
HOC1: R18.1 U12.13(HO3)
HOC2: R21.1 U13.13(HO3)
KEYMOD: R6.1 U11.15(P6.6)
LEDMOD: LED3.1(K) U11.14(P6.5)
LOA1: R22.1 U12.11(LO1)
LOA2: R25.1 U13.11(LO1)
LOB1: R23.1 U12.10(LO2)
LOB2: R26.1 U13.10(LO2)
LOC1: R24.1 U12.9(LO3)
LOC2: R27.1 U13.9(LO3)
PWM1AH: U11.38(P14.0) U12.22(HIN1)
PWM1AL: U11.39(P14.1) U12.1(LIN1)
PWM1BH: U11.44(P18.4) U12.23(HIN2)
PWM1BL: U11.45(P18.5) U12.2(LIN2)
PWM1CH: U11.46(P18.6) U12.24(HIN3)
PWM1CL: U11.47(P18.7) U12.3(LIN3)
PWM2AH: U11.3(P0.2) U13.22(HIN1)
PWM2AL: U11.4(P0.3) U13.1(LIN1)
PWM2BH: U11.5(P2.0) U13.23(HIN2)
PWM2BL: U11.6(P2.1) U13.2(LIN2)
PWM2CH: U11.7(P5.0) U13.24(HIN3)
PWM2CL: U11.8(P5.1) U13.3(LIN3)
RST: C43.2 R12.1 R13.1 SW1.3 SW1.4 U7.7
SWCLK: U7.6 U11.62(P23.5)
SWDIO: U7.5 U11.63(P23.6)
UART_RX: R7.1 U11.18(P7.0)
UART_TX: CN1.4 U11.19(P7.1)
VBA1: C30.2 D4.2(K) U12.20(VB1)
VBA2: C31.2 D5.2(K) U13.20(VB1)
VBB1: C35.2 D6.2(K) U12.17(VB2)
VBB2: C36.2 D7.2(K) U13.17(VB2)
VBC1: C45.1 D10.2(K) U12.14(VB3)
VBC2: C46.1 D11.2(K) U13.14(VB3)
VREFH: C20.2 C21.2 R8.2 U11.29(VREFH)
VREFL: C20.1 C21.1 R10.2 U11.26(VREFL)
VSA1: C30.1 U12.18(VS1) U14.1(S) U14.2(S) U14.3(S) U20.5(D) U20.6(D) U20.7(D) U20.8(D) U20.9(D)
VSA2: C31.1 U13.18(VS1) U17.1(S) U17.2(S) U17.3(S) U23.5(D) U23.6(D) U23.7(D) U23.8(D) U23.9(D)
VSB1: C35.1 U12.15(VS2) U15.1(S) U15.2(S) U15.3(S) U21.5(D) U21.6(D) U21.7(D) U21.8(D) U21.9(D)
VSB2: C36.1 U13.15(VS2) U18.1(S) U18.2(S) U18.3(S) U24.5(D) U24.6(D) U24.7(D) U24.8(D) U24.9(D)
VSC1: C45.2 U12.12(VS3) U16.1(S) U16.2(S) U16.3(S) U22.5(D) U22.6(D) U22.7(D) U22.8(D) U22.9(D)
VSC2: C46.2 U13.12(VS3) U19.1(S) U19.2(S) U19.3(S) U25.5(D) U25.6(D) U25.7(D) U25.8(D) U25.9(D)
XRES_L: R12.2 U11.54(XRES_L)
$1N10004: R4.2 R6.2 SW2.3 SW2.4
$1N10532: LED2.2(A) R9.2
$1N10536: LED3.2(A) R11.2
$1N11613: C1.1 U5.6(BST)
$1N11614: C1.2 U5.5(SW) U6.1
$1N11615: C2.2 C3.2 C4.2 D1.2(K) U5.2(EN) U5.3(VIN)
$1N11617: LED1.2(A) R3.2
$1N13568: C37.2 D4.1(A) D6.1(A) D8.1(K) D10.1(A) R14.2 U12.4(VCC)
$1N14919: C38.2 D5.1(A) D7.1(A) D9.1(K) D11.1(A) R15.2 U13.4(VCC)
$1N15713: R16.2 U14.4(G)
$1N16660: R17.2 U15.4(G)
$1N16734: R18.2 U16.4(G)
$1N16932: R22.2 U20.4(G)
$1N16944: R23.2 U21.4(G)
$1N16956: R24.2 U22.4(G)
$1N17340: R19.2 U17.4(G)
$1N17352: R20.2 U18.4(G)
$1N17364: R21.2 U19.4(G)
$1N17376: R25.2 U23.4(G)
$1N17388: R26.2 U24.4(G)
$1N17400: R27.2 U25.4(G)
$1N18423: CN1.3 R7.2
$1N19068: C13.1 U9.6(BST)
$1N19069: C13.2 U9.5(SW) U10.1
$1N19070: C22.2 C23.2 C24.2 D3.2(K) U9.2(EN) U9.3(VIN)

Not connected (* = marked no-connect by the designer): ECODER1 7* 8*; ECODER2 7* 8*; U7 8* 9*; U11 13(P6.4)* 21(P8.0)* 22(P8.1)* 23(P11.0)* 24(P11.1)* 25(P11.2)* 30(P12.0)* 31(P12.1)* 40(P14.2)* 41(P18.0)* 42(P18.1)* 43(P18.3)* 50(P21.0)* 51(P21.1)* 59(P22.0)* 60(P23.3)* 61(P23.4)* 64(P23.7)*; U12 5(NC)* 7(NC)* 8(NC)* 21(NC)*; U13 5(NC)* 7(NC)* 8(NC)* 21(NC)*

## Notes on the sheet
- 5v电源
- 复位与模式选择
- 电压检测
- 磁编串口
- 螺丝孔
- 下载接口
- 指示灯
- 3.3v
- 晶振
- 电源噪声隔离与滤波
- 输入储能电容
- 栅极驱动芯片
- cyt核心
- 电源输入&串口
- nmosfet
